# EAGLE schematic STBlitter_RevC2 (EAGLE 9.4.2)
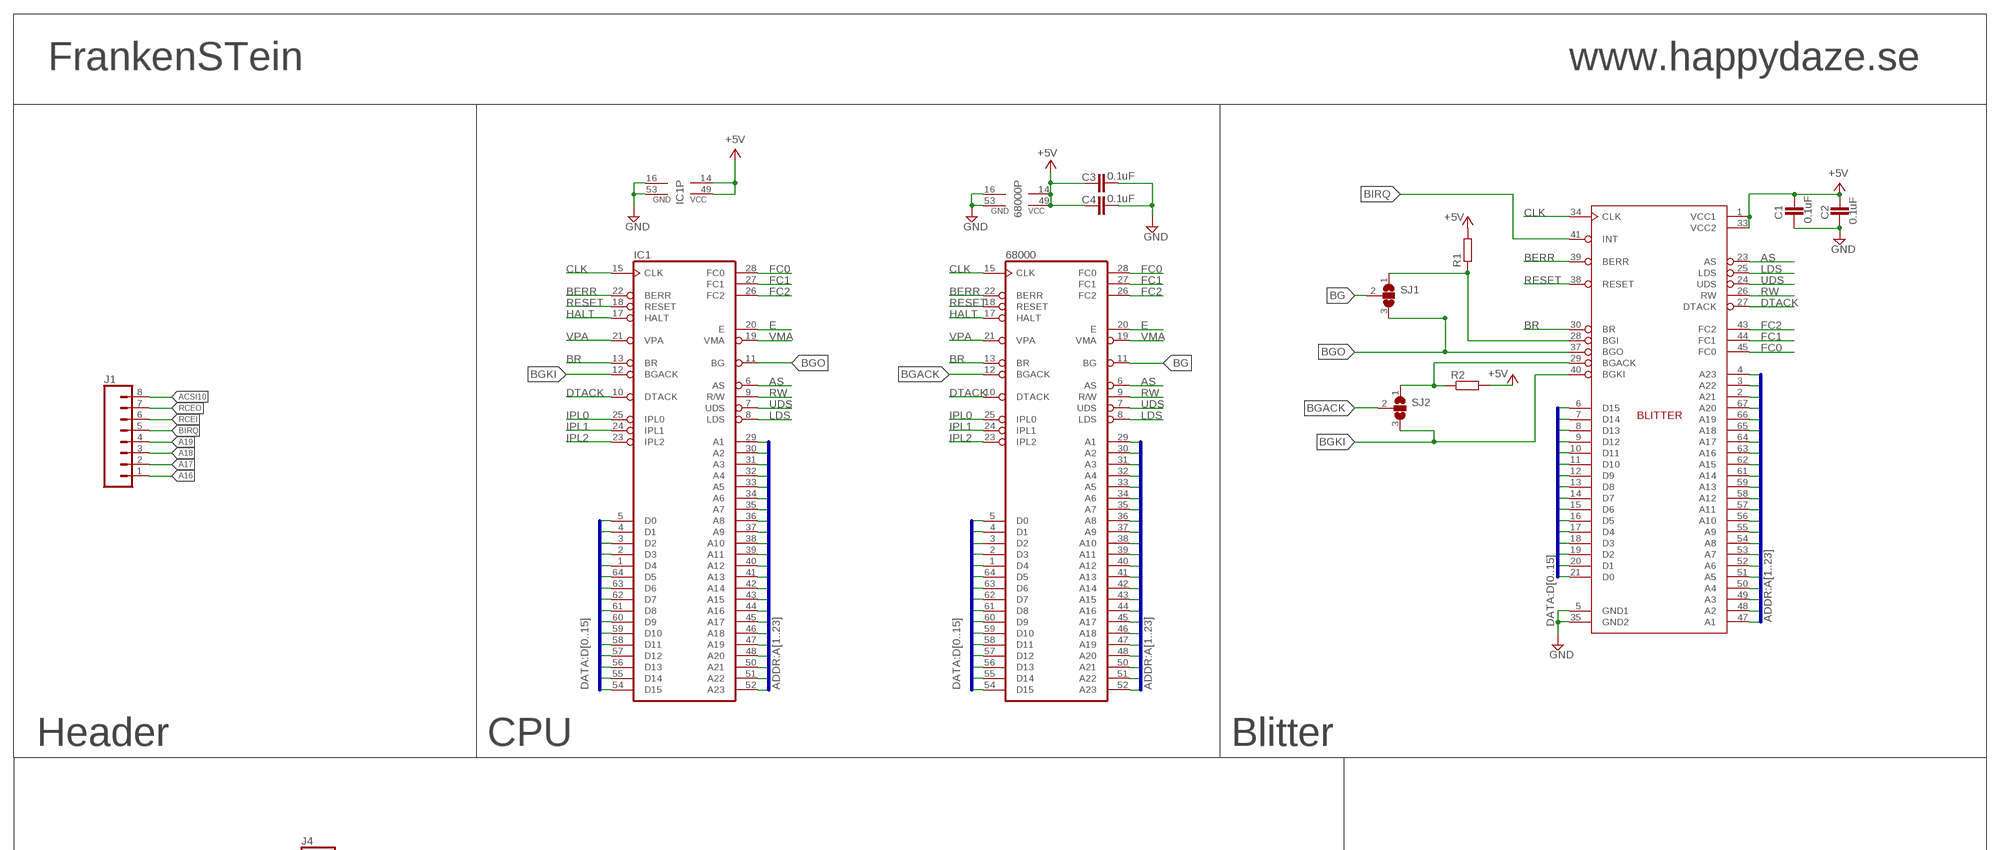
[diagram p0: schematic, sheet 1, part 1 of 2]
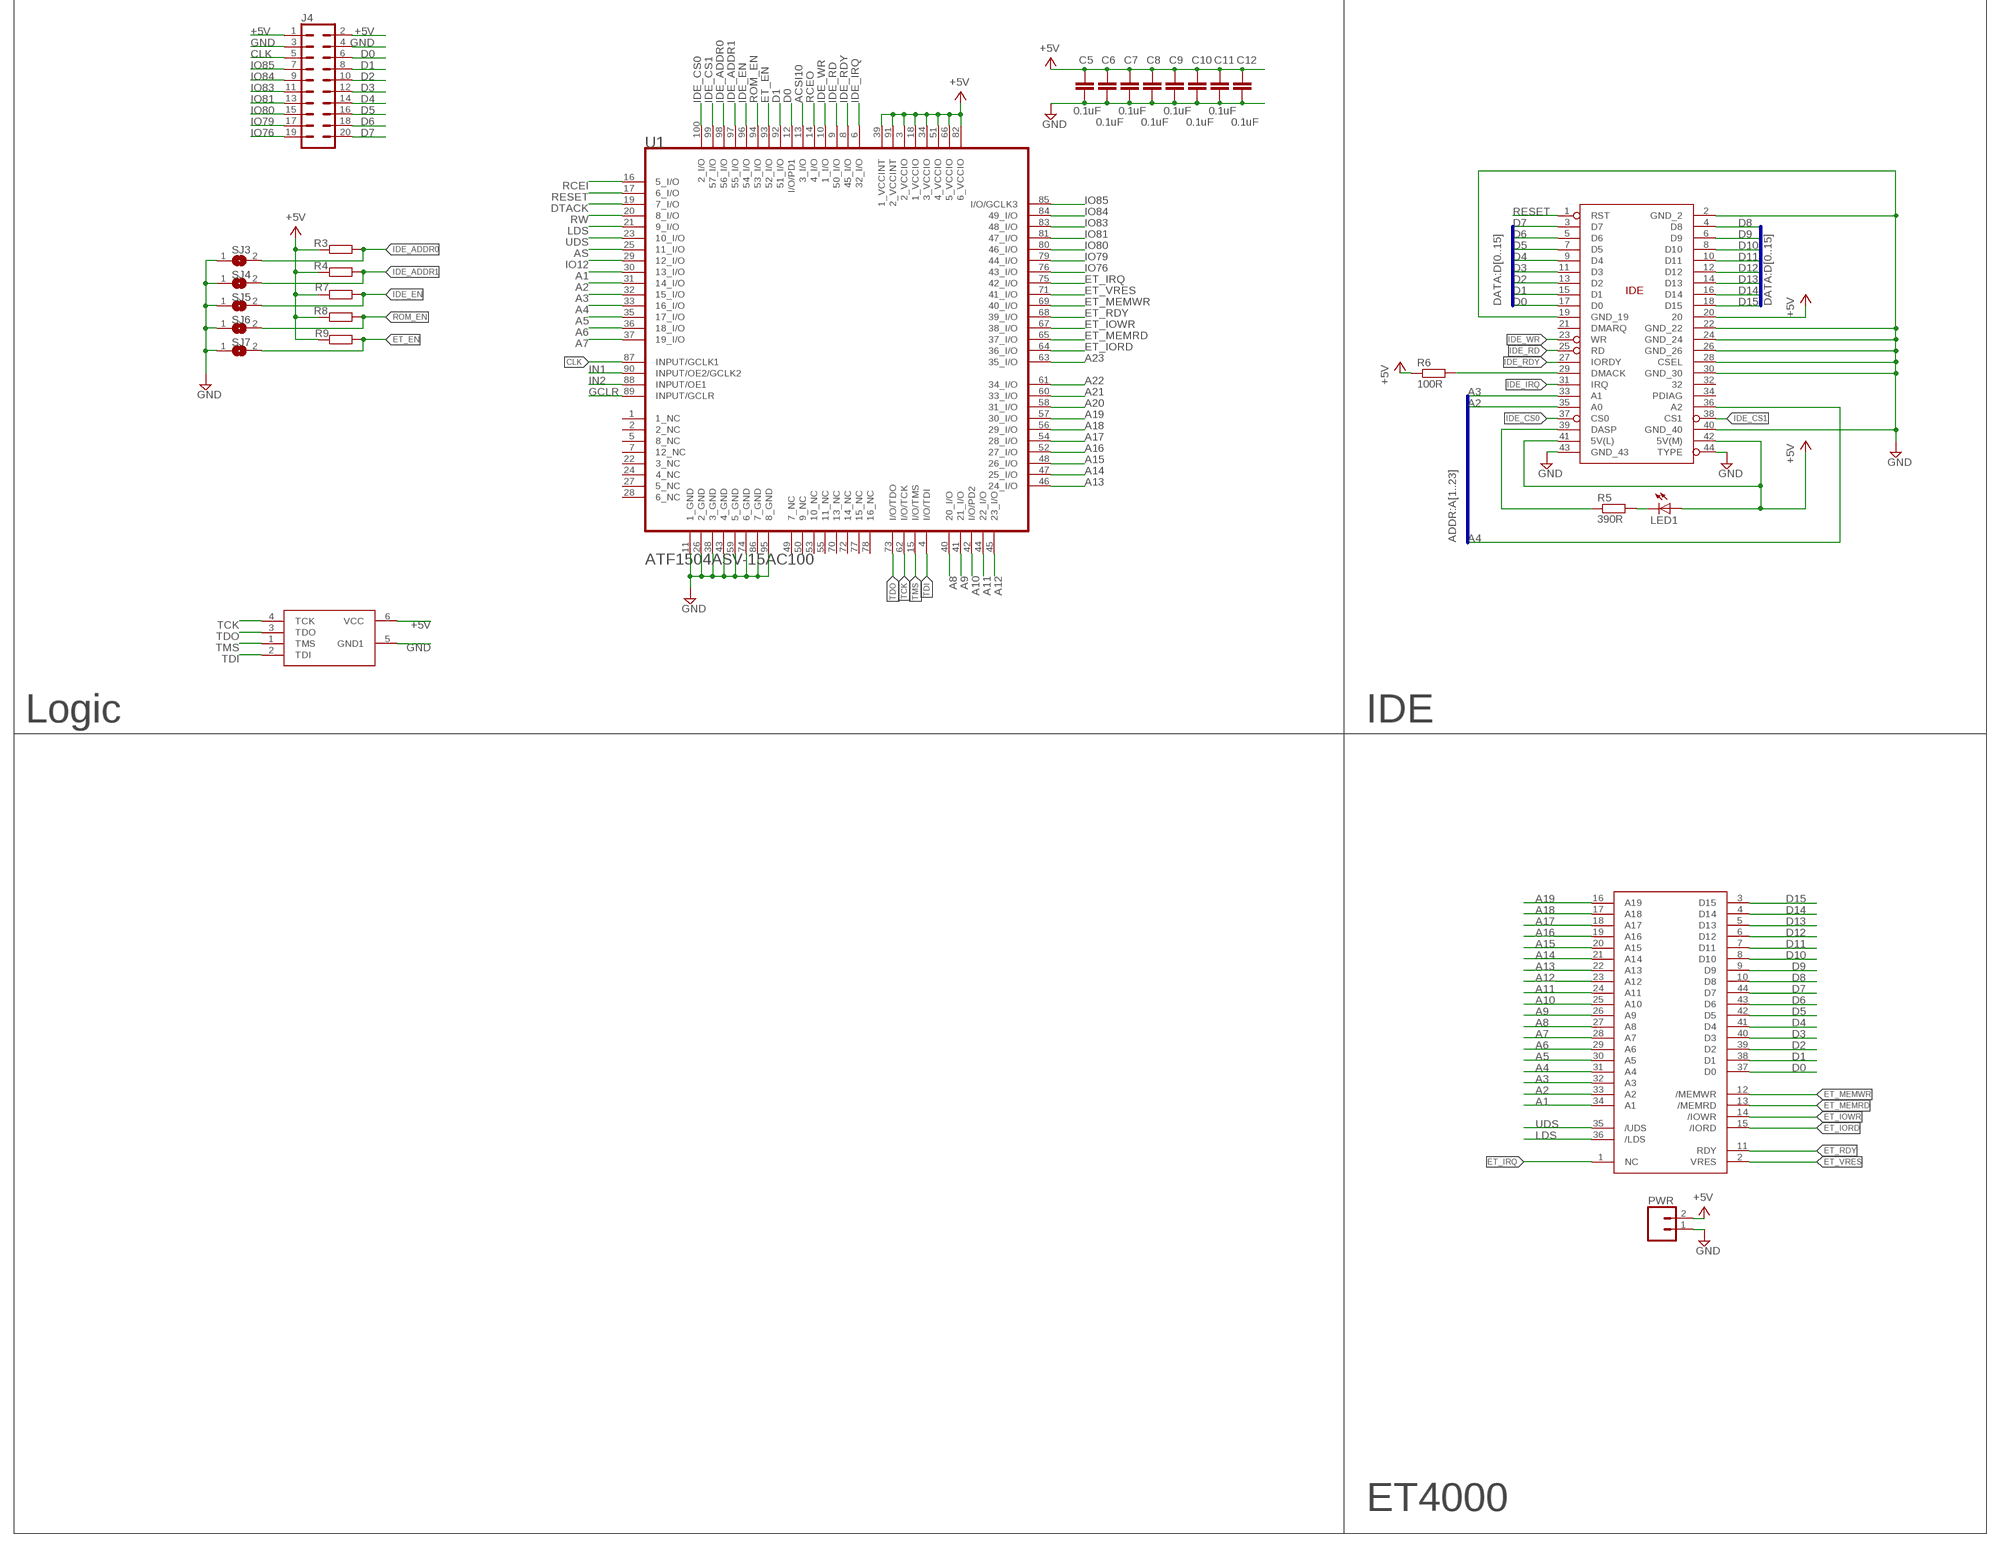
[diagram p1: schematic, sheet 1, part 2 of 2]

## Parts
68000  MC68000P  [DIL64]
BLITTER  STBLITTER  [PLCC68-S]
C1  0.1uF  C-EUC0805  [C0805]
C2  0.1uF  C-EUC0805  [C0805]
C3  0.1uF  C-EUC0805  [C0805]
C4  0.1uF  C-EUC0805  [C0805]
C5  0.1uF  C-EUC0805  [C0805]
C6  0.1uF  C-EUC0805  [C0805]
C7  0.1uF  C-EUC0805  [C0805]
C8  0.1uF  C-EUC0805  [C0805]
C9  0.1uF  C-EUC0805  [C0805]
C10  0.1uF  C-EUC0805  [C0805]
C11  0.1uF  C-EUC0805  [C0805]
C12  0.1uF  C-EUC0805  [C0805]
CFCARD  IDE44_CON  [IDE44_CON]
IC1  MC68000P2  [DIL64_SOCKET]
J1  CONN_08"  [1X08]
J4  CONN_10X2  [2X10]
JTAG  JTAG_ATDH2  [JTAG_ATDH2]
LED1  LED3MM  [LED3MM]
PWR  CONN_02  [1X02]
R1  R-EU_R0805  [R0805]
R2  R-EU_R0805  [R0805]
R3  R-EU_R0805  [R0805]
R4  R-EU_R0805  [R0805]
R5  390R  R-EU_R0805  [R0805]
R6  100R  R-EU_R0805  [R0805]
R7  R-EU_R0805  [R0805]
R8  R-EU_R0805  [R0805]
R9  R-EU_R0805  [R0805]
SJ1  SJ2W  [SJ_2]
SJ2  SJ2W  [SJ_2]
SJ3  SJ  [SJ]
SJ4  SJ  [SJ]
SJ5  SJ  [SJ]
SJ6  SJ  [SJ]
SJ7  SJ  [SJ]
STGA  STGA  [STGACON]
U1  ATF1504_SMD100MICROCHIP_-_ATMEL_ATF1504ASV-15AC100_0_1  [MICROCHIP_-_ATMEL_ATF1504ASV-15AC100_1]

## Nets
+5V [PWR]: 68000.14(VCC) 68000.49(VCC) BLITTER.1(VCC1) BLITTER.33(VCC2) C1.1 C2.1 C3.1 C4.1 C5.2 C6.2 C7.2 C8.2 C9.2 C10.2 C11.2 C12.2 CFCARD.20 CFCARD.41(5V(L)) CFCARD.42(5V(M)) IC1.14(VCC) IC1.49(VCC) J4.1 J4.2 JTAG.6(VCC) LED1.A PWR.2 R1.2 R2.2 R3.1 R4.1 R6.1 R7.1 R8.1 R9.1 U1.3(2_VCCIO) U1.18(1_VCCIO) U1.34(3_VCCIO) U1.39(1_VCCINT) U1.51(4_VCCIO) U1.66(5_VCCIO) U1.82(6_VCCIO) U1.91(2_VCCINT)
_BGACK: BLITTER.29(BGACK) R2.1 SJ2.1
A1: 68000.29(A1) BLITTER.47(A1) IC1.29(A1) STGA.34(A1) U1.30(13_I/O)
A2: 68000.30(A2) BLITTER.48(A2) CFCARD.35(A0) IC1.30(A2) STGA.33(A2) U1.31(14_I/O)
A3: 68000.31(A3) BLITTER.49(A3) CFCARD.33(A1) IC1.31(A3) STGA.32(A3) U1.32(15_I/O)
A4: 68000.32(A4) BLITTER.50(A4) CFCARD.36(A2) IC1.32(A4) STGA.31(A4) U1.33(16_I/O)
A5: 68000.33(A5) BLITTER.51(A5) IC1.33(A5) STGA.30(A5) U1.35(17_I/O)
A6: 68000.34(A6) BLITTER.52(A6) IC1.34(A6) STGA.29(A6) U1.36(18_I/O)
A7: 68000.35(A7) BLITTER.53(A7) IC1.35(A7) STGA.28(A7) U1.37(19_I/O)
A8: 68000.36(A8) BLITTER.54(A8) IC1.36(A8) STGA.27(A8) U1.40(20_I/O)
A9: 68000.37(A9) BLITTER.55(A9) IC1.37(A9) STGA.26(A9) U1.41(21_I/O)
A10: 68000.38(A10) BLITTER.56(A10) IC1.38(A10) STGA.25(A10) U1.42(I/O/PD2)
A11: 68000.39(A11) BLITTER.57(A11) IC1.39(A11) STGA.24(A11) U1.44(22_I/O)
A12: 68000.40(A12) BLITTER.58(A12) IC1.40(A12) STGA.23(A12) U1.45(23_I/O)
A13: 68000.41(A13) BLITTER.59(A13) IC1.41(A13) STGA.22(A13) U1.46(24_I/O)
A14: 68000.42(A14) BLITTER.61(A14) IC1.42(A14) STGA.21(A14) U1.47(25_I/O)
A15: 68000.43(A15) BLITTER.62(A15) IC1.43(A15) STGA.20(A15) U1.48(26_I/O)
A16: 68000.44(A16) BLITTER.63(A16) IC1.44(A16) J1.1 STGA.19(A16) U1.52(27_I/O)
A17: 68000.45(A17) BLITTER.64(A17) IC1.45(A17) J1.2 STGA.18(A17) U1.54(28_I/O)
A18: 68000.46(A18) BLITTER.65(A18) IC1.46(A18) J1.3 STGA.17(A18) U1.56(29_I/O)
A19: 68000.47(A19) BLITTER.66(A19) IC1.47(A19) J1.4 STGA.16(A19) U1.57(30_I/O)
A20: 68000.48(A20) BLITTER.67(A20) IC1.48(A20) U1.58(31_I/O)
A21: 68000.50(A21) BLITTER.2(A21) IC1.50(A21) U1.60(33_I/O)
A22: 68000.51(A22) BLITTER.3(A22) IC1.51(A22) U1.61(34_I/O)
A23: 68000.52(A23) BLITTER.4(A23) IC1.52(A23) U1.63(35_I/O)
ACSI10: J1.8 U1.13(3_I/O)
AS: 68000.6(AS) BLITTER.23(AS) IC1.6(AS) U1.25(11_I/O)
BERR: 68000.22(BERR) BLITTER.39(BERR) IC1.22(BERR)
BG: 68000.11(BG) SJ1.2
BGACK: 68000.12(BGACK) SJ2.2
BGKI: BLITTER.40(BGKI) IC1.12(BGACK) SJ2.3
BGO: BLITTER.37(BGO) IC1.11(BG) SJ1.3
BIRQ: BLITTER.41(INT) J1.5
BLTBGI: BLITTER.28(BGI) R1.1 SJ1.1
BR: 68000.13(BR) BLITTER.30(BR) IC1.13(BR)
CLK: 68000.15(CLK) BLITTER.34(CLK) IC1.15(CLK) J4.5 U1.87(INPUT/GCLK1)
D0: 68000.5(D0) BLITTER.21(D0) CFCARD.17(D0) IC1.5(D0) J4.6 STGA.37(D0) U1.12(I/O/PD1)
D1: 68000.4(D1) BLITTER.20(D1) CFCARD.15(D1) IC1.4(D1) J4.8 STGA.38(D1) U1.92(51_I/O)
D2: 68000.3(D2) BLITTER.19(D2) CFCARD.13(D2) IC1.3(D2) J4.10 STGA.39(D2)
D3: 68000.2(D3) BLITTER.18(D3) CFCARD.11(D3) IC1.2(D3) J4.12 STGA.40(D3)
D4: 68000.1(D4) BLITTER.17(D4) CFCARD.9(D4) IC1.1(D4) J4.14 STGA.41(D4)
D5: 68000.64(D5) BLITTER.16(D5) CFCARD.7(D5) IC1.64(D5) J4.16 STGA.42(D5)
D6: 68000.63(D6) BLITTER.15(D6) CFCARD.5(D6) IC1.63(D6) J4.18 STGA.43(D6)
D7: 68000.62(D7) BLITTER.14(D7) CFCARD.3(D7) IC1.62(D7) J4.20 STGA.44(D7)
D8: 68000.61(D8) BLITTER.13(D8) CFCARD.4(D8) IC1.61(D8) STGA.10(D8)
D9: 68000.60(D9) BLITTER.12(D9) CFCARD.6(D9) IC1.60(D9) STGA.9(D9)
D10: 68000.59(D10) BLITTER.11(D10) CFCARD.8(D10) IC1.59(D10) STGA.8(D10)
D11: 68000.58(D11) BLITTER.10(D11) CFCARD.10(D11) IC1.58(D11) STGA.7(D11)
D12: 68000.57(D12) BLITTER.9(D12) CFCARD.12(D12) IC1.57(D12) STGA.6(D12)
D13: 68000.56(D13) BLITTER.8(D13) CFCARD.14(D13) IC1.56(D13) STGA.5(D13)
D14: 68000.55(D14) BLITTER.7(D14) CFCARD.16(D14) IC1.55(D14) STGA.4(D14)
D15: 68000.54(D15) BLITTER.6(D15) CFCARD.18(D15) IC1.54(D15) STGA.3(D15)
DASP: CFCARD.39(DASP) R5.1
DMACK: CFCARD.29(DMACK) R6.2
DTACK: 68000.10(DTACK) BLITTER.27(DTACK) IC1.10(DTACK) U1.19(7_I/O)
E: 68000.20(E) IC1.20(E)
ET_EN: R9.2 SJ7.2 U1.93(52_I/O)
ET_IORD: STGA.15(/IORD) U1.64(36_I/O)
ET_IOWR: STGA.14(/IOWR) U1.67(38_I/O)
ET_IRQ: STGA.1(NC) U1.75(42_I/O)
ET_MEMRD: STGA.13(/MEMRD) U1.65(37_I/O)
ET_MEMWR: STGA.12(/MEMWR) U1.69(40_I/O)
ET_RDY: STGA.11(RDY) U1.68(39_I/O)
ET_VRES: STGA.2(VRES) U1.71(41_I/O)
FC0: 68000.28(FC0) BLITTER.45(FC0) IC1.28(FC0)
FC1: 68000.27(FC1) BLITTER.44(FC1) IC1.27(FC1)
FC2: 68000.26(FC2) BLITTER.43(FC2) IC1.26(FC2)
GCLR: U1.89(INPUT/GCLR)
GND [GND]: 68000.16(GND) 68000.53(GND) BLITTER.5(GND1) BLITTER.35(GND2) C1.2 C2.2 C3.2 C4.2 C5.1 C6.1 C7.1 C8.1 C9.1 C10.1 C11.1 C12.1 CFCARD.2(GND_2) CFCARD.19(GND_19) CFCARD.22(GND_22) CFCARD.24(GND_24) CFCARD.26(GND_26) CFCARD.28(CSEL) CFCARD.30(GND_30) CFCARD.40(GND_40) CFCARD.43(GND_43) CFCARD.44(TYPE) IC1.16(GND) IC1.53(GND) J4.3 J4.4 JTAG.5(GND1) PWR.1 SJ3.1 SJ4.1 SJ5.1 SJ6.1 SJ7.1 U1.11(1_GND) U1.26(2_GND) U1.38(3_GND) U1.43(4_GND) U1.59(5_GND) U1.74(6_GND) U1.86(7_GND) U1.95(8_GND)
HALT: 68000.17(HALT) IC1.17(HALT)
IDE_ADDR0: R3.2 SJ3.2 U1.98(56_I/O)
IDE_ADDR1: R4.2 SJ4.2 U1.97(55_I/O)
IDE_CS0: CFCARD.37(CS0) U1.100(2_I/O)
IDE_CS1: CFCARD.38(CS1) U1.99(57_I/O)
IDE_EN: R7.2 SJ5.2 U1.96(54_I/O)
IDE_IRQ: CFCARD.31(IRQ) U1.6(32_I/O)
IDE_RD: CFCARD.25(RD) U1.9(50_I/O)
IDE_RDY: CFCARD.27(IORDY) U1.8(45_I/O)
IDE_WR: CFCARD.23(WR) U1.10(1_I/O)
IN1: U1.90(INPUT/OE2/GCLK2)
IN2: U1.88(INPUT/OE1)
IO12: U1.29(12_I/O)
IO76: J4.19 U1.76(43_I/O)
IO79: J4.17 U1.79(44_I/O)
IO80: J4.15 U1.80(46_I/O)
IO81: J4.13 U1.81(47_I/O)
IO83: J4.11 U1.83(48_I/O)
IO84: J4.9 U1.84(49_I/O)
IO85: J4.7 U1.85(I/O/GCLK3)
IPL0: 68000.25(IPL0) IC1.25(IPL0)
IPL1: 68000.24(IPL1) IC1.24(IPL1)
IPL2: 68000.23(IPL2) IC1.23(IPL2)
LDS: 68000.8(LDS) BLITTER.25(LDS) IC1.8(LDS) STGA.36(/LDS) U1.21(9_I/O)
N$14: LED1.K(C) R5.2
RCEI: J1.6 U1.16(5_I/O)
RCEO: J1.7 U1.14(4_I/O)
RESET: 68000.18(RESET) BLITTER.38(RESET) CFCARD.1(RST) IC1.18(RESET) U1.17(6_I/O)
ROM_EN: R8.2 SJ6.2 U1.94(53_I/O)
RW: 68000.9(R/W) BLITTER.26(RW) IC1.9(R/W) U1.20(8_I/O)
TCK: JTAG.4(TCK) U1.62(I/O/TCK)
TDI: JTAG.2(TDI) U1.4(I/O/TDI)
TDO: JTAG.3(TDO) U1.73(I/O/TDO)
TMS: JTAG.1(TMS) U1.15(I/O/TMS)
UDS: 68000.7(UDS) BLITTER.24(UDS) IC1.7(UDS) STGA.35(/UDS) U1.23(10_I/O)
VMA: 68000.19(VMA) IC1.19(VMA)
VPA: 68000.21(VPA) IC1.21(VPA)
Unconnected: CFCARD.21(DMARQ) CFCARD.32 CFCARD.34(PDIAG) U1.1(1_NC) U1.2(2_NC) U1.5(8_NC) U1.7(12_NC) U1.22(3_NC) U1.24(4_NC) U1.27(5_NC) U1.28(6_NC) U1.49(7_NC) U1.50(9_NC) U1.53(10_NC) U1.55(11_NC) U1.70(13_NC) U1.72(14_NC) U1.77(15_NC) U1.78(16_NC)

## Buses
DATA:D[0..15]
ADDR:A[1..23]

## Notes on the sheet
- FrankenSTein | www.happydaze.se
- Header | CPU | Blitter
- Logic | IDE
- ET4000

## Library data of the parts
68000 = micro-mc68000:MC68000P: 68xxx PROCESSOR; OC_FARNELL: unknown; OC_NEWARK: unknown
BLITTER = AtariST:STBLITTER
C1-C12 = rcl:C-EU: CAPACITOR, European symbol; SPICEPREFIX: C
CFCARD = AtariST:IDE44_CON
IC1 = AtariST:MC68000P2: 68xxx PROCESSOR; OC_FARNELL: unknown; OC_NEWARK: unknown
J1 = SparkFun-Connectors:CONN_08: Multi connection point. Often used as Generic Header-pin footprint for 0.1 inch spaced/style header connections On any of the 0.1 inch spaced packages, you can populate with these: Break Away Headers - Straight <https://www.sparkfun.com/products/116> (PRT-00116) Break Away Male Headers - Right Angle <https://www.sparkfun.com/products/553> (PRT-00553) Female Headers <https://www.sparkfun.com/products/115> (PRT-00115) Break Away Headers - Machine Pin <https://www.sparkfun.com/products/117> (PRT-00117) Break Away Female Headers - Swiss Machine Pin <https://www.sparkfun.com/products/743> (PRT-00743) Arduino Stackable Header - 8 Pin <https://www.sparkfun.com/products/9279> (PRT-09279) For SCREWTERMINALS and SPRING TERMINALS visit here: Screw Terimnals on SparkFun.com <https://www.sparkfun.com/search/results?term=Screw+Terminals> (5mm/3.5mm/2.54mm spacing) This device is also useful as a general connection point to wire up your design to another part of your project. Our various solder wires solder well into these plated through hole pads. Hook-Up Wire - Assortment (Stranded, 22 AWG) <https://www.sparkfun.com/products/11375> (PRT-11375) Hook-Up Wire - Assortment (Solid Core, 22 AWG) <https://www.sparkfun.com/products/11367> (PRT-11367) View the entire wire category on our website here <https://www.sparkfun.com/categories/141> Special notes: Molex polarized connector foot print use with SKU : PRT-08231 with associated crimp pins and housings. 1MM SMD Version SKU: PRT-10208 NOTES ON THE VARIANTS LOCK and LOCK_LONGPADS... This footprint was designed to help hold the alignment of a through-hole component (i.e. 6-pin header) while soldering it into place. You may notice that each hole has been shifted either up or down by 0.005 of an inch from it's more standard position (which is a perfectly straight line). This slight alteration caused the pins (the squares in the middle) to touch the edges of the holes. Because they are alternating, it causes a "brace" to hold the component in place. 0.005 has proven to be the perfect amount of "off-center" position when using our standard breakaway headers. Although looks a little odd when you look at the bare footprint, once you have a header in there, the alteration is very hard to notice. Also,if you push a header all the way into place, it is covered up entirely on the bottom side.; PROD_ID: CONN-08438
J4 = SparkFun-Connectors:CONN_10X2: Multi connection point. Often used as Generic Header-pin footprint for 0.1 inch spaced/style header connections On any of the 0.1 inch spaced packages, you can populate with these: Break Away Headers - Straight <https://www.sparkfun.com/products/116> (PRT-00116) Break Away Male Headers - Right Angle <https://www.sparkfun.com/products/553> (PRT-00553) Female Headers <https://www.sparkfun.com/products/115> (PRT-00115) Break Away Headers - Machine Pin <https://www.sparkfun.com/products/117> (PRT-00117) Break Away Female Headers - Swiss Machine Pin <https://www.sparkfun.com/products/743> (PRT-00743) Special note about the "SPECIAL" package: This was SPECIALLY designed to be used with our Graphic LCD Backpack. Be sure you want to use this! It is not only staggered on each line of header holes, but IT IS ALSO offset of the center point of the top and bottom lines by 5 mil. This causes the headers to lock into place on the "standard" footprint on the LCD screen. The extra squares on the tdocu layer are there simply to reference other pins (if you were to actually populate a longer header than ten long - this is what we do with the backpacks).
JTAG = AtariST:JTAG_ATDH2
LED1 = led:LED: LED OSRAM: - CHIPLED LG R971, LG N971, LY N971, LG Q971, LY Q971, LO R971, LY R971 LH N974, LH R974 LS Q976, LO Q976, LY Q976 LO Q996 - Hyper CHIPLED LW Q18S LB Q993, LB Q99A, LB R99A - SideLED LS A670, LO A670, LY A670, LG A670, LP A670 LB A673, LV A673, LT A673, LW A673 LH A674 LY A675 LS A676, LA A676, LO A676, LY A676, LW A676 LS A679, LY A679, LG A679 - Hyper Micro SIDELED® LS Y876, LA Y876, LO Y876, LY Y876 LT Y87S - SmartLED LW L88C, LW L88S LB L89C, LB L89S, LG L890 LS L89K, LO L89K, LY L89K LS L896, LA L896, LO L896, LY L896 - TOPLED LS T670, LO T670, LY T670, LG T670, LP T670 LSG T670, LSP T670, LSY T670, LOP T670, LYG T670 LG T671, LOG T671, LSG T671 LB T673, LV T673, LT T673, LW T673 LH T674 LS T676, LA T676, LO T676, LY T676, LB T676, LH T676, LSB T676, LW T676 LB T67C, LV T67C, LT T67C, LS T67K, LO T67K, LY T67K, LW E67C LS E67B, LA E67B, LO E67B, LY E67B, LB E67C, LV E67C, LT E67C LW T67C LS T679, LY T679, LG T679 LS T770, LO T770, LY T770, LG T770, LP T770 LB T773, LV T773, LT T773, LW T773 LH T774 LS E675, LA E675, LY E675, LS T675 LS T776, LA T776, LO T776, LY T776, LB T776 LHGB T686 LT T68C, LB T68C - Hyper Mini TOPLED® LB M676 - Mini TOPLED Santana® LG M470 LS M47K, LO M47K, LY M47K Source: http://www.osram.convergy.de LUXEON: - LUMILED® LXK2-PW12-R00, LXK2-PW12-S00, LXK2-PW14-U00, LXK2-PW14-V00 LXK2-PM12-R00, LXK2-PM12-S00, LXK2-PM14-U00 LXK2-PE12-Q00, LXK2-PE12-R00, LXK2-PE12-S00, LXK2-PE14-T00, LXK2-PE14-U00 LXK2-PB12-K00, LXK2-PB12-L00, LXK2-PB12-M00, LXK2-PB14-N00, LXK2-PB14-P00, LXK2-PB14-Q00 LXK2-PR12-L00, LXK2-PR12-M00, LXK2-PR14-Q00, LXK2-PR14-R00 LXK2-PD12-Q00, LXK2-PD12-R00, LXK2-PD12-S00 LXK2-PH12-R00, LXK2-PH12-S00 LXK2-PL12-P00, LXK2-PL12-Q00, LXK2-PL12-R00 Source: www.luxeon.com KINGBRIGHT: KA-3528ASYC Source: www.kingbright.com
PWR = SparkFun-Connectors:CONN_02: Multi connection point. Often used as Generic Header-pin footprint for 0.1 inch spaced/style header connections On any of the 0.1 inch spaced packages, you can populate with these: Break Away Headers - Straight <https://www.sparkfun.com/products/116> (PRT-00116) Break Away Male Headers - Right Angle <https://www.sparkfun.com/products/553> (PRT-00553) Female Headers <https://www.sparkfun.com/products/115> (PRT-00115) Break Away Headers - Machine Pin <https://www.sparkfun.com/products/117> (PRT-00117) Break Away Female Headers - Swiss Machine Pin <https://www.sparkfun.com/products/743> (PRT-00743) For SCREWTERMINALS and SPRING TERMINALS visit here: Screw Terimnals on SparkFun.com <https://www.sparkfun.com/search/results?term=Screw+Terminals> (5mm/3.5mm/2.54mm spacing) This device is also useful as a general connection point to wire up your design to another part of your project. Our various solder wires solder well into these plated through hole pads. Hook-Up Wire - Assortment (Stranded, 22 AWG) <https://www.sparkfun.com/products/11375> (PRT-11375) Hook-Up Wire - Assortment (Solid Core, 22 AWG) <https://www.sparkfun.com/products/11367> (PRT-11367) View the entire wire category on our website here <https://www.sparkfun.com/categories/141> Special notes: Molex polarized connector foot print use with: PRT-08233 with associated crimp pins and housings. 2.54_SCREWTERM for use with PRT-10571. 3.5mm Screw Terminal footprints for PRT-08084 5mm Screw Terminal footprints for use with PRT-08432
R1-R9 = rcl:R-EU_: RESISTOR, European symbol; SPICEPREFIX: R
SJ1 SJ2 = jumper:SJ2W: SMD solder JUMPER
SJ3-SJ7 = jumper:SJ: SMD solder JUMPER
STGA = AtariST:STGA
U1 = AtariST:ATF1504_SMD100: PLD-ATF15-1504AS-SQ100A; CIIVA_IDS: 1126453; CODE__JEDEC: MS-026-AED; DATASHEET_VERSION: Rev. 1409I-PLD-2/03; FOOTPRINT_VARIANT_NAME_0: Level C; FOOTPRINT_VARIANT_NAME_1: Level B; FOOTPRINT_VARIANT_NAME_2: Level A; IMPORTED: yes; IMPORTED_FROM: vault; IMPORT_TS: 1521844975; MF: Microchip / Atmel; MPN: ATF1504ASV-15AC100; PACKAGE: 100T1; PACKAGE_DESCRIPTION: 100-Pin Thin Quad Flat Pack 0.5 mm Pitch; PACKAGE_VERSION: rev.A, Nov-2001; PIN_0_0_1_INSIDE_EDGE: clock; PIN_0_0_61_INSIDE_EDGE: clock; PIN_0_0_82_INSIDE_EDGE: clock; PIN_0_0_89_INSIDE_EDGE: clock; PREFIX: U; RELEASE_DATE: 1302236712; VAULT_GUID: 13629FCB-FDAA-432A-99ED-1027C5F9713A; VAULT_REVISION: 0C7A58DA-8507-4CBE-AD49-F102968C7F1C

## Net classes
0 default: width 0.178 mm
1 PWR: width 0.305 mm
2 GND: width 0.305 mm